# Altium schematic sheet LARIX_V5_0.SchDoc
size 409 x 282 mm; >DRAWING_NAME: LARIX_V5.sch; >LAST_DATE_TIME: 05.02.2016 10:43:52; >SHEET: 1; Sheet:: Sheet:; Legal Disclaimer: Legal Disclaimer; The information given in this document shall in no event be regarded as a guarantee of conditions or: The information given in this document shall in no event be regarded as a guarantee of conditions or; characteristics. With respect to any examples or hints given herein, any typical values stated herein and/or any: characteristics. With respect to any examples or hints given herein, any typical values stated herein and/or any; information regarding the application of the device, Infineon Technologies hereby disclaims any and all warranties: information regarding the application of the device, Infineon Technologies hereby disclaims any and all warranties; and liabilities of any kind, including without limitation, warranties of non-infringement of intellectual property rights: and liabilities of any kind, including without limitation, warranties of non-infringement of intellectual property rights; of any third party.: of any third party.
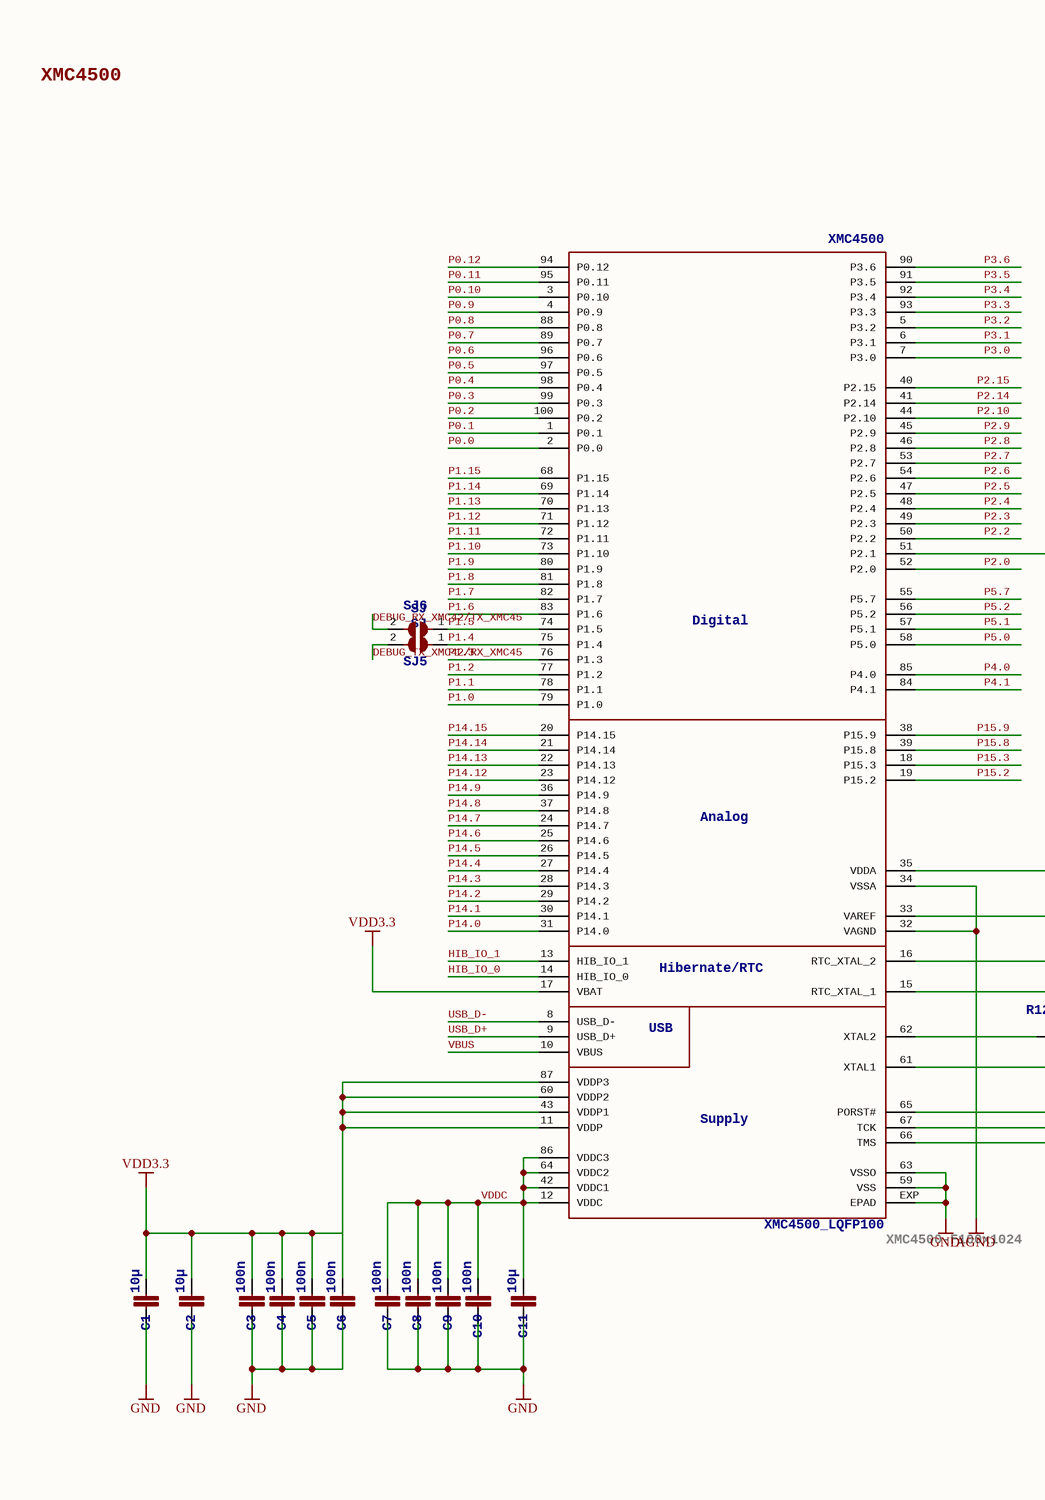
[diagram p0: LARIX_V5_0.SchDoc, left]
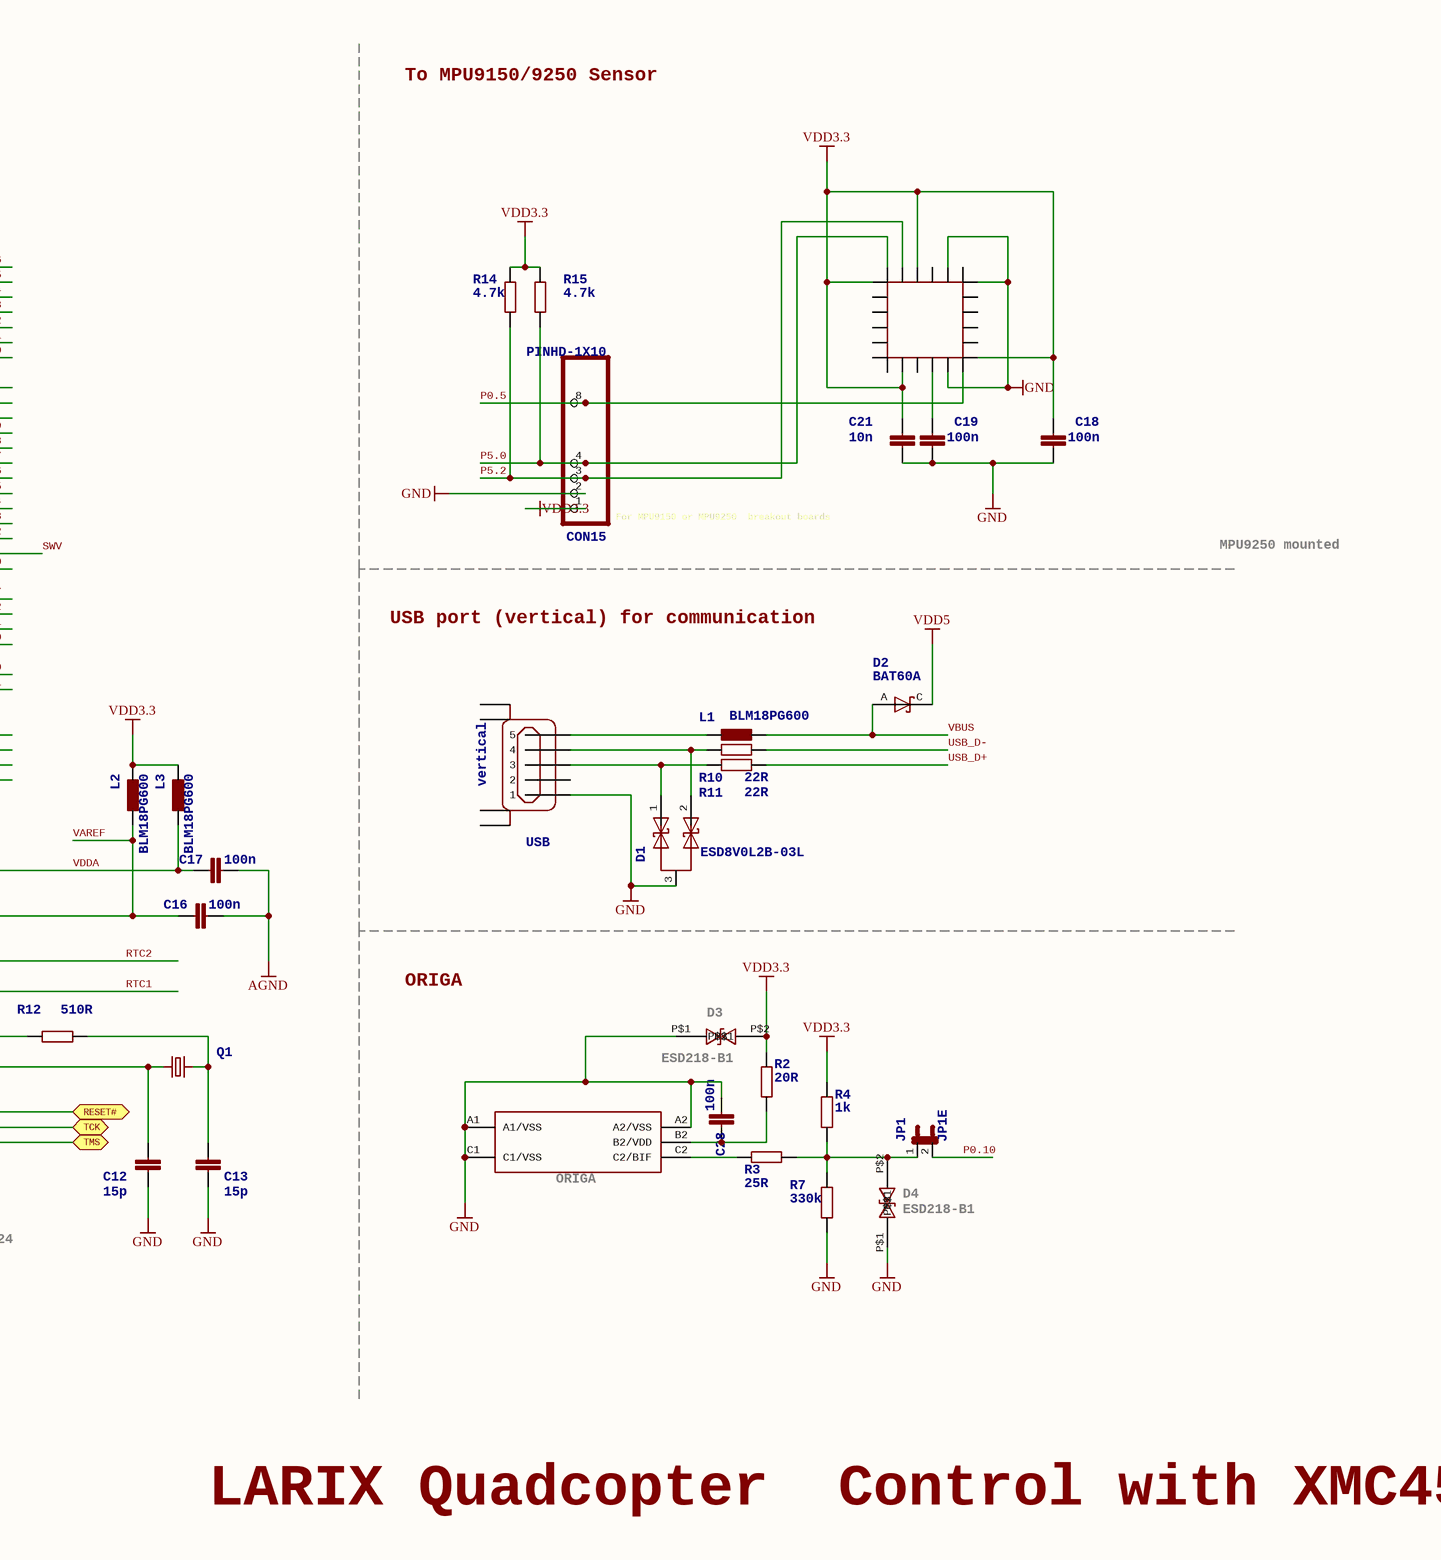
[diagram p1: LARIX_V5_0.SchDoc, right]

## Parts
C1  10µ  [C0805K]
C2  10µ  [C0805K]
C3  100n  [C0603]
C4  100n  [C0603]
C5  100n  [C0603]
C6  100n  [C0603]
C7  100n  [C0603]
C8  100n  [C0603]
C9  100n  [C0603]
C10  100n  [C0603]
C11  10µ  [C0805K]
C12  15p  [C0603]
C13  15p  [C0603]
C16  100n  [C0603]
C17  100n  [C0603]
C18  100n  [C0603]
C19  100n  [C0603]
C21  10n  [C0603]
C28  100n  [C0603]
CON15  >NAME: CON15  [1X10]  (hidden comment: PINHD-1X10)
D1  ESD8V0L2B-03L  [TSLP-3-1]
D2  BAT60A  [SOD323-R]
D3  ESD218-B1-02EL  [TSLP-2-20]  (value not drawn)
D4  ESD218-B1-02EL  [TSLP-2-20]  (value not drawn)
JP1  JP1E  [JP1]
L1  BLM18PG600  [L1608]
L2  >NAME: L2  [L1608]  (hidden comment: BLM18PG600)
L3  >NAME: L3  [L1608]  (hidden comment: BLM18PG600)
MPU9250  MPU9250  [QFN3X3-24+]  (value not drawn)
ORIGA  ORIGA2L  [WLB-5]  (value not drawn)
Q1  12MHZ/S/3.2X2.5  [32X25_4PAD]  (value not drawn)
R2  20R  [R0603]
R3  25R  [R0603]
R4  1k  [R0603]
R7  330k  [R0603]
R10  22R  [R0603]
R11  22R  [R0603]
R12  510R  [R0603]
R14  4.7k  [R0603]
R15  4.7k  [R0603]
SJ5  SJ  [SJ]
SJ6  SJ  [SJ]
USB  vertical  [USBVERTICAL]
XMC4500  >NAME: XMC4500  [P/PG-LQFP-100-11]  (hidden comment: XMC4500_LQFP100)

## Ports
RESET#, TCK, TMS

## Nets
AGND: C16.2 C17.2 XMC4500.32(VAGND) XMC4500.34(VSSA)
GND: C1.2 C2.2 C3.2 C4.2 C5.2 C6.2 C7.2 C8.2 C9.2 C10.2 C11.2 C12.2 C13.2 C18.1 C19.1 C21.1 C28.1 CON15.2 D1.3 D3.P$1 D4.P$1 MPU9250.11 MPU9250.18 MPU9250.20 ORIGA.A1(A1/VSS) ORIGA.A2(A2/VSS) ORIGA.C1(C1/VSS) R7.2 USB.1 XMC4500.59(VSS) XMC4500.63(VSSO) XMC4500.EXP(EPAD)
VDD3.3: C1.1 C2.1 C3.1 C4.1 C5.1 C6.1 C18.2 C21.2 CON15.1 D3.P$2 L2.2 L3.2 MPU9250.1 MPU9250.8 MPU9250.13 MPU9250.22 R2.1 R4.1 R14.2 R15.2 XMC4500.11(VDDP) XMC4500.17(VBAT) XMC4500.43(VDDP1) XMC4500.60(VDDP2) XMC4500.87(VDDP3)
VDD5: D2.C
DEBUG_RX_XMC42/TX_XMC45: SJ6.2
DEBUG_TX_XMC42/RX_XMC45: SJ5.2
HIB_IO_0: XMC4500.14(HIB_IO_0)
HIB_IO_1: XMC4500.13(HIB_IO_1)
P0.0: XMC4500.2(P0.0)
P0.1: XMC4500.1(P0.1)
P0.2: XMC4500.100(P0.2)
P0.3: XMC4500.99(P0.3)
P0.4: XMC4500.98(P0.4)
P0.5: CON15.8 MPU9250.12 XMC4500.97(P0.5)
P0.6: XMC4500.96(P0.6)
P0.7: XMC4500.89(P0.7)
P0.8: XMC4500.88(P0.8)
P0.9: XMC4500.4(P0.9)
P0.10: JP1.2 XMC4500.3(P0.10)
P0.11: XMC4500.95(P0.11)
P0.12: XMC4500.94(P0.12)
P1.0: XMC4500.79(P1.0)
P1.1: XMC4500.78(P1.1)
P1.2: XMC4500.77(P1.2)
P1.3: XMC4500.76(P1.3)
P1.4: SJ5.1 XMC4500.75(P1.4)
P1.5: SJ6.1 XMC4500.74(P1.5)
P1.6: XMC4500.83(P1.6)
P1.7: XMC4500.82(P1.7)
P1.8: XMC4500.81(P1.8)
P1.9: XMC4500.80(P1.9)
P1.10: XMC4500.73(P1.10)
P1.11: XMC4500.72(P1.11)
P1.12: XMC4500.71(P1.12)
P1.13: XMC4500.70(P1.13)
P1.14: XMC4500.69(P1.14)
P1.15: XMC4500.68(P1.15)
P2.0: XMC4500.52(P2.0)
P2.2: XMC4500.50(P2.2)
P2.3: XMC4500.49(P2.3)
P2.4: XMC4500.48(P2.4)
P2.5: XMC4500.47(P2.5)
P2.6: XMC4500.54(P2.6)
P2.7: XMC4500.53(P2.7)
P2.8: XMC4500.46(P2.8)
P2.9: XMC4500.45(P2.9)
P2.10: XMC4500.44(P2.10)
P2.14: XMC4500.41(P2.14)
P2.15: XMC4500.40(P2.15)
P3.0: XMC4500.7(P3.0)
P3.1: XMC4500.6(P3.1)
P3.2: XMC4500.5(P3.2)
P3.3: XMC4500.93(P3.3)
P3.4: XMC4500.92(P3.4)
P3.5: XMC4500.91(P3.5)
P3.6: XMC4500.90(P3.6)
P4.0: XMC4500.85(P4.0)
P4.1: XMC4500.84(P4.1)
P5.0: CON15.4 MPU9250.24 R15.1 XMC4500.58(P5.0)
P5.1: XMC4500.57(P5.1)
P5.2: CON15.3 MPU9250.23 R14.1 XMC4500.56(P5.2)
P5.7: XMC4500.55(P5.7)
P14.0: XMC4500.31(P14.0)
P14.1: XMC4500.30(P14.1)
P14.2: XMC4500.29(P14.2)
P14.3: XMC4500.28(P14.3)
P14.4: XMC4500.27(P14.4)
P14.5: XMC4500.26(P14.5)
P14.6: XMC4500.25(P14.6)
P14.7: XMC4500.24(P14.7)
P14.8: XMC4500.37(P14.8)
P14.9: XMC4500.36(P14.9)
P14.12: XMC4500.23(P14.12)
P14.13: XMC4500.22(P14.13)
P14.14: XMC4500.21(P14.14)
P14.15: XMC4500.20(P14.15)
P15.2: XMC4500.19(P15.2)
P15.3: XMC4500.18(P15.3)
P15.8: XMC4500.39(P15.8)
P15.9: XMC4500.38(P15.9)
RESET#: XMC4500.65(PORST#) ; port RESET#
RTC1: XMC4500.15(RTC_XTAL_1)
RTC2: XMC4500.16(RTC_XTAL_2)
SWV: XMC4500.51(P2.1)
TCK: XMC4500.67(TCK) ; port TCK
TMS: XMC4500.66(TMS) ; port TMS
USB_D+: R11.2 XMC4500.9(USB_D+)
USB_D-: R10.2 XMC4500.8(USB_D-)
VAREF: C16.1 L2.1 XMC4500.33(VAREF)
VBUS: D2.A L1.1 XMC4500.10(VBUS)
VDDA: C17.1 L3.1 XMC4500.35(VDDA)
VDDC: C7.1 C8.1 C9.1 C10.1 C11.1 XMC4500.12(VDDC) XMC4500.42(VDDC1) XMC4500.64(VDDC2) XMC4500.86(VDDC3)
NetC12_1: C12.1 Q1.1 XMC4500.61(XTAL1)
NetC13_1: C13.1 Q1.3 R12.2
NetC19_2: C19.2 MPU9250.10
NetC28_2: C28.2 ORIGA.B2(B2/VDD) R2.2
NetD1_1: D1.1 R11.1 USB.3+(3)
NetD1_2: D1.2 R10.1 USB.4
NetD4_P$2: D4.P$2 JP1.1 R3.2 R4.2 R7.1
NetL1_2: L1.2 USB.5
NetORIGA_C2: ORIGA.C2(C2/BIF) R3.1
NetR12_1: R12.1 XMC4500.62(XTAL2)

Not connected (* = marked no-connect by the designer): MPU9250 2 3 4 5 6 7 9 14 15 16 17 19 21; USB 2 P$1(PGH1) P$2(PGH2) P$3(PGH3) P$4(PGH4)

## Notes on the sheet
- XMC4500
- To MPU9150/9250 Sensor
- (near CON15) For MPU9150
  or MPU9250
  breakout boards
- MPU9250 mounted
- USB port (vertical) for communication
- ORIGA
- (near D3) D3
- (near D3) ESD218-B1
- (near ORIGA) ORIGA
- (near XMC4500) XMC4500-F100x1024
- (near D4) D4
- (near D4) ESD218-B1
- LARIX Quadcopter
  Control with XMC4500
- 1
- 2
- 3
- 4
- 5
- 6
- 7
- 8
- A
- B
- C
- D
- E

## Library data of the parts
C1 C2 C11 = C-EUC0805K: <B>CAPACITOR</B>, European symbol
C3-C10 C12 C13 C16-C19 C21 C28 = C-EUC0603: <B>CAPACITOR</B>, European symbol
CON15 = PINHD-1X10: <b>PIN HEADER</b>; >VALUE: PINHD-1X10
D2 = BAT60
JP1 = JP1E: <b>JUMPER</b>; >NAME: JP1; >VALUE: JP1E
L1-L3 = L_EU_L0603
  L2 L3: >VALUE: BLM18PG600
MPU9250 = INVENSENSE9250HERBY: Herbys Model of a invensense 9250
Q1 = NX3225_2
R2-R4 R7 R12 = R-EU_R0603
R10 R11 R14 R15 = R-EU_R0603: <B>RESISTOR</B>, European symbol
SJ5 SJ6 = SJ: SMD solder <b>JUMPER</b>
USB = MICRO_USB_VERTICAL
XMC4500 = XMC4400_LQFP100: >VALUE: XMC4500_LQFP100; USB: USB; Supply: Supply; Analog: Analog; Digital: Digital; Hibernate/RTC: Hibernate/RTC